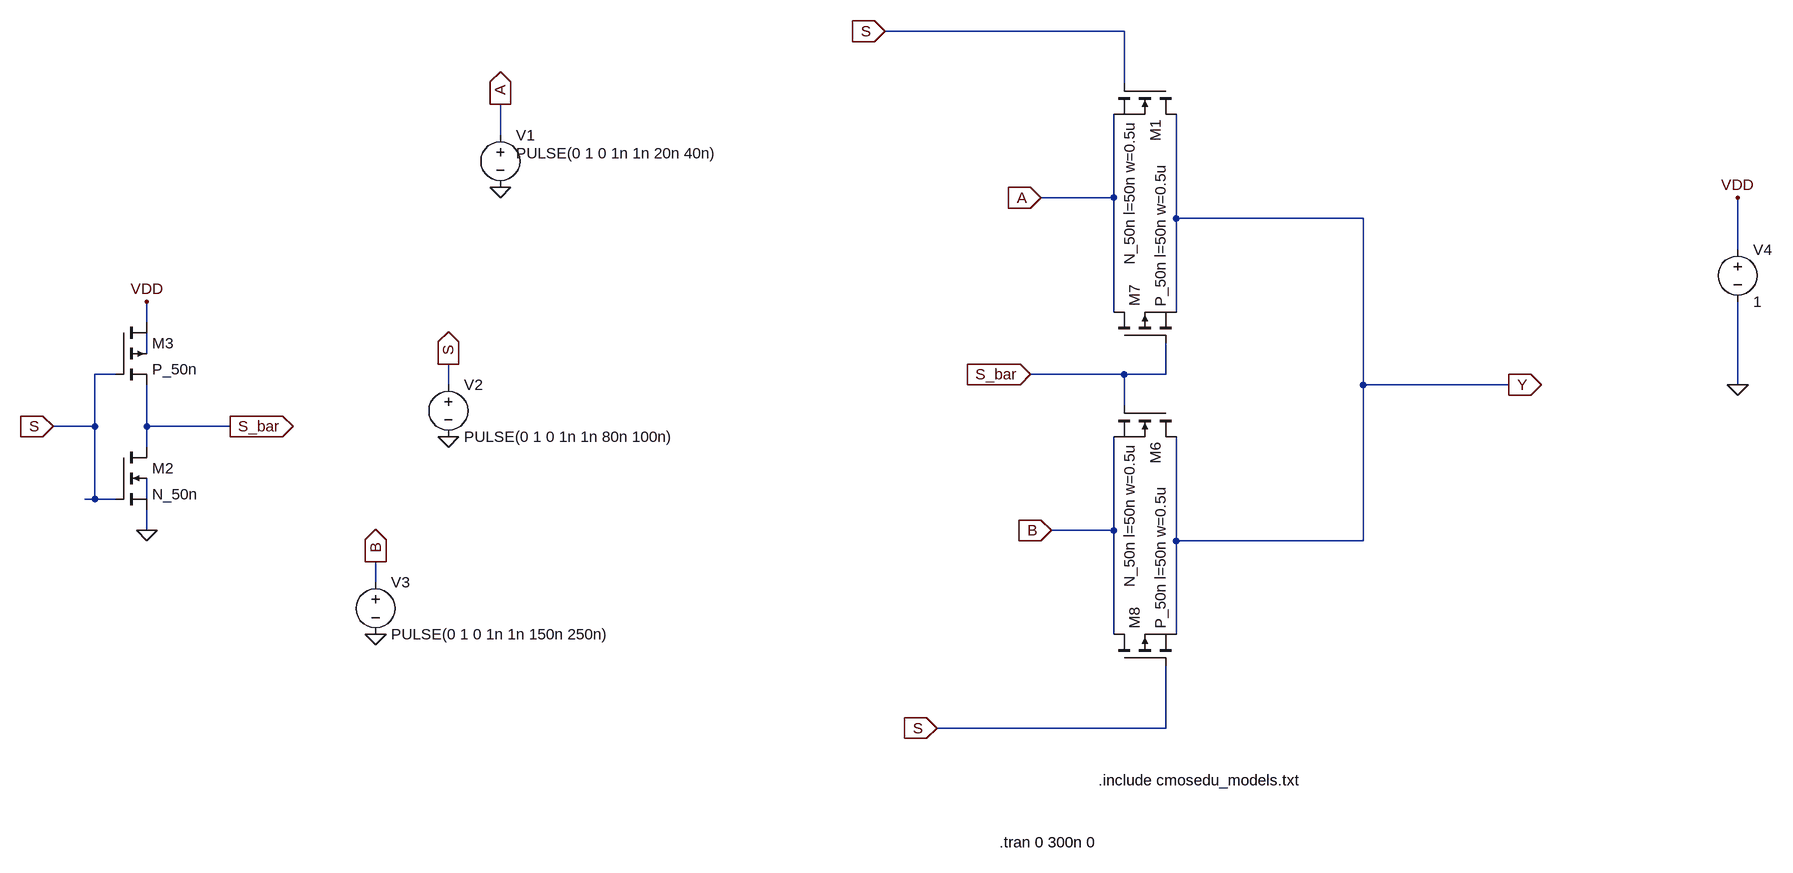
[diagram p0: schematic EXP7.asc]
EXP7.asc, the LTspice schematic file:
Version 4
SHEET 1 1512 680
WIRE 512 -800 144 -800
WIRE 512 -720 512 -800
WIRE -448 -640 -448 -688
WIRE 496 -544 496 -672
WIRE 496 -544 384 -544
WIRE 592 -512 592 -672
WIRE 880 -512 592 -512
WIRE 1456 -464 1456 -544
WIRE 496 -368 496 -544
WIRE 592 -368 592 -512
WIRE -992 -352 -992 -384
WIRE -992 -304 -992 -336
WIRE -1040 -272 -1072 -272
WIRE 512 -272 368 -272
WIRE 576 -272 576 -320
WIRE 576 -272 512 -272
WIRE -528 -256 -528 -288
WIRE 880 -256 880 -512
WIRE 1104 -256 880 -256
WIRE 1456 -256 1456 -384
WIRE 512 -224 512 -272
WIRE -1072 -192 -1072 -272
WIRE -1072 -192 -1136 -192
WIRE -992 -192 -992 -256
WIRE -864 -192 -992 -192
WIRE -992 -160 -992 -192
WIRE -1072 -80 -1072 -192
WIRE -1072 -80 -1088 -80
WIRE -1040 -80 -1072 -80
WIRE -992 -80 -992 -112
WIRE -992 -32 -992 -64
WIRE 496 -32 496 -176
WIRE 496 -32 400 -32
WIRE 592 -16 592 -176
WIRE 880 -16 880 -256
WIRE 880 -16 592 -16
WIRE -640 48 -640 16
WIRE 496 128 496 -32
WIRE 592 128 592 -16
WIRE 576 272 576 176
WIRE 576 272 224 272
FLAG 144 -800 S
IOPIN 144 -800 In
FLAG 224 272 S
IOPIN 224 272 In
FLAG 1104 -256 Y
IOPIN 1104 -256 Out
FLAG -528 -176 0
FLAG -640 128 0
FLAG -448 -560 0
FLAG 384 -544 A
IOPIN 384 -544 In
FLAG 400 -32 B
IOPIN 400 -32 In
FLAG 368 -272 S_bar
IOPIN 368 -272 In
FLAG -448 -688 A
IOPIN -448 -688 Out
FLAG -528 -288 S
IOPIN -528 -288 Out
FLAG -640 16 B
IOPIN -640 16 Out
FLAG -992 -384 VDD
FLAG 1456 -544 VDD
FLAG -992 -32 0
FLAG 1456 -256 0
FLAG -1136 -192 S
IOPIN -1136 -192 In
FLAG -864 -192 S_bar
IOPIN -864 -192 Out
SYMBOL nmos 592 -224 R90
SYMATTR InstName M6
SYMATTR Value N_50n l=50n w=0.5u
SYMBOL pmos 496 -320 R270
SYMATTR InstName M7
SYMATTR Value P_50n l=50n w=0.5u
SYMBOL pmos 496 176 R270
SYMATTR InstName M8
SYMATTR Value P_50n l=50n w=0.5u
SYMBOL nmos 592 -720 R90
SYMATTR InstName M1
SYMATTR Value N_50n l=50n w=0.5u
SYMBOL voltage -528 -272 R0
WINDOW 123 0 0 Left 0
WINDOW 39 0 0 Left 0
SYMATTR InstName V2
SYMATTR Value PULSE(0 1 0 1n 1n 80n 100n)
SYMBOL voltage -640 32 R0
WINDOW 123 0 0 Left 0
WINDOW 39 0 0 Left 0
SYMATTR InstName V3
SYMATTR Value PULSE(0 1 0 1n 1n 150n 250n)
SYMBOL voltage -448 -656 R0
WINDOW 3 24 44 Left 2
WINDOW 123 0 0 Left 0
WINDOW 39 0 0 Left 0
SYMATTR InstName V1
SYMATTR Value PULSE(0 1 0 1n 1n 20n 40n)
SYMBOL nmos4 -1040 -160 R0
SYMATTR InstName M2
SYMATTR Value N_50n
SYMATTR Value2 l=50n w=0.5u
SYMBOL pmos4 -1040 -352 R0
SYMATTR InstName M3
SYMATTR Value P_50n
SYMATTR Value2 l=50n w=0.5u
SYMBOL voltage 1456 -480 R0
WINDOW 123 0 0 Left 0
WINDOW 39 0 0 Left 0
SYMATTR InstName V4
SYMATTR Value 1
TEXT 472 352 Left 2 !.include cmosedu_models.txt
TEXT 320 448 Left 2 !.tran 0 300n 0

The netlist it stands for:
* EXP7.asc
M6 Y S_bar B B N_50n l=50n w=0.5u
M7 A S_bar Y Y P_50n l=50n w=0.5u
M8 B S Y Y P_50n l=50n w=0.5u
M1 Y S A A N_50n l=50n w=0.5u
V2 S 0 PULSE(0 1 0 1n 1n 80n 100n)
V3 B 0 PULSE(0 1 0 1n 1n 150n 250n)
V1 A 0 PULSE(0 1 0 1n 1n 20n 40n)
M2 S_bar S 0 N002 N_50n l=50n w=0.5u
M3 VDD S S_bar N001 P_50n l=50n w=0.5u
V4 VDD 0 1
.model NMOS NMOS
.model PMOS PMOS
.lib standard.mos
.include cmosedu_models.txt
.tran 0 300n 0
.backanno
.end